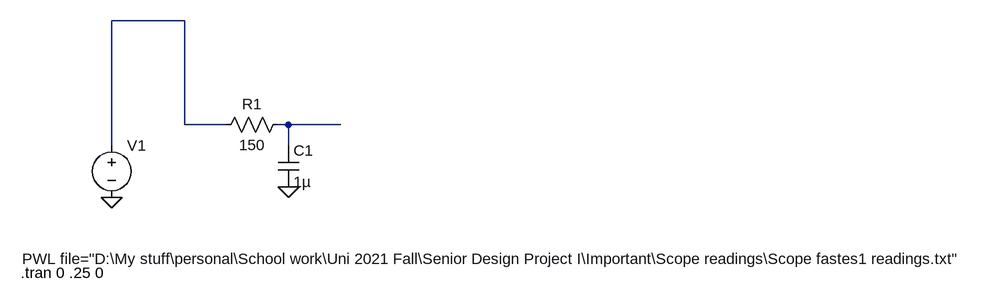
[diagram p0: schematic Draft1.asc]
Draft1.asc, the LTspice schematic file:
Version 4
SHEET 1 1576 680
WIRE 32 -64 -80 -64
WIRE 32 96 32 -64
WIRE 96 96 32 96
WIRE 192 96 176 96
WIRE 272 96 192 96
WIRE -80 128 -80 -64
WIRE 192 128 192 96
FLAG -80 208 0
FLAG 192 192 0
SYMBOL voltage -80 112 R0
WINDOW 3 -138 191 Left 2
WINDOW 123 0 0 Left 0
WINDOW 39 0 0 Left 0
SYMATTR InstName V1
SYMATTR Value PWL file="D:\My stuff\personal\School work\Uni 2021 Fall\Senior Design Project I\Important\Scope readings\Scope fastes1 readings.txt"
SYMBOL res 80 112 R270
WINDOW 0 32 56 VTop 2
WINDOW 3 0 56 VBottom 2
SYMATTR InstName R1
SYMATTR Value 150
SYMBOL cap 176 128 R0
SYMATTR InstName C1
SYMATTR Value 1µ
TEXT -220 324 Left 2 !.tran 0 .25 0

The netlist it stands for:
* Draft1.asc
V1 N001 0 PWL file="D:\My stuff\personal\School work\Uni 2021 Fall\Senior Design Project I\Important\Scope readings\Scope fastes1 readings.txt"
R1 N001 N002 150
C1 N002 0 1µ
.tran 0 .25 0
.backanno
.end